# EAGLE schematic LaserCutter (EAGLE 6.2)
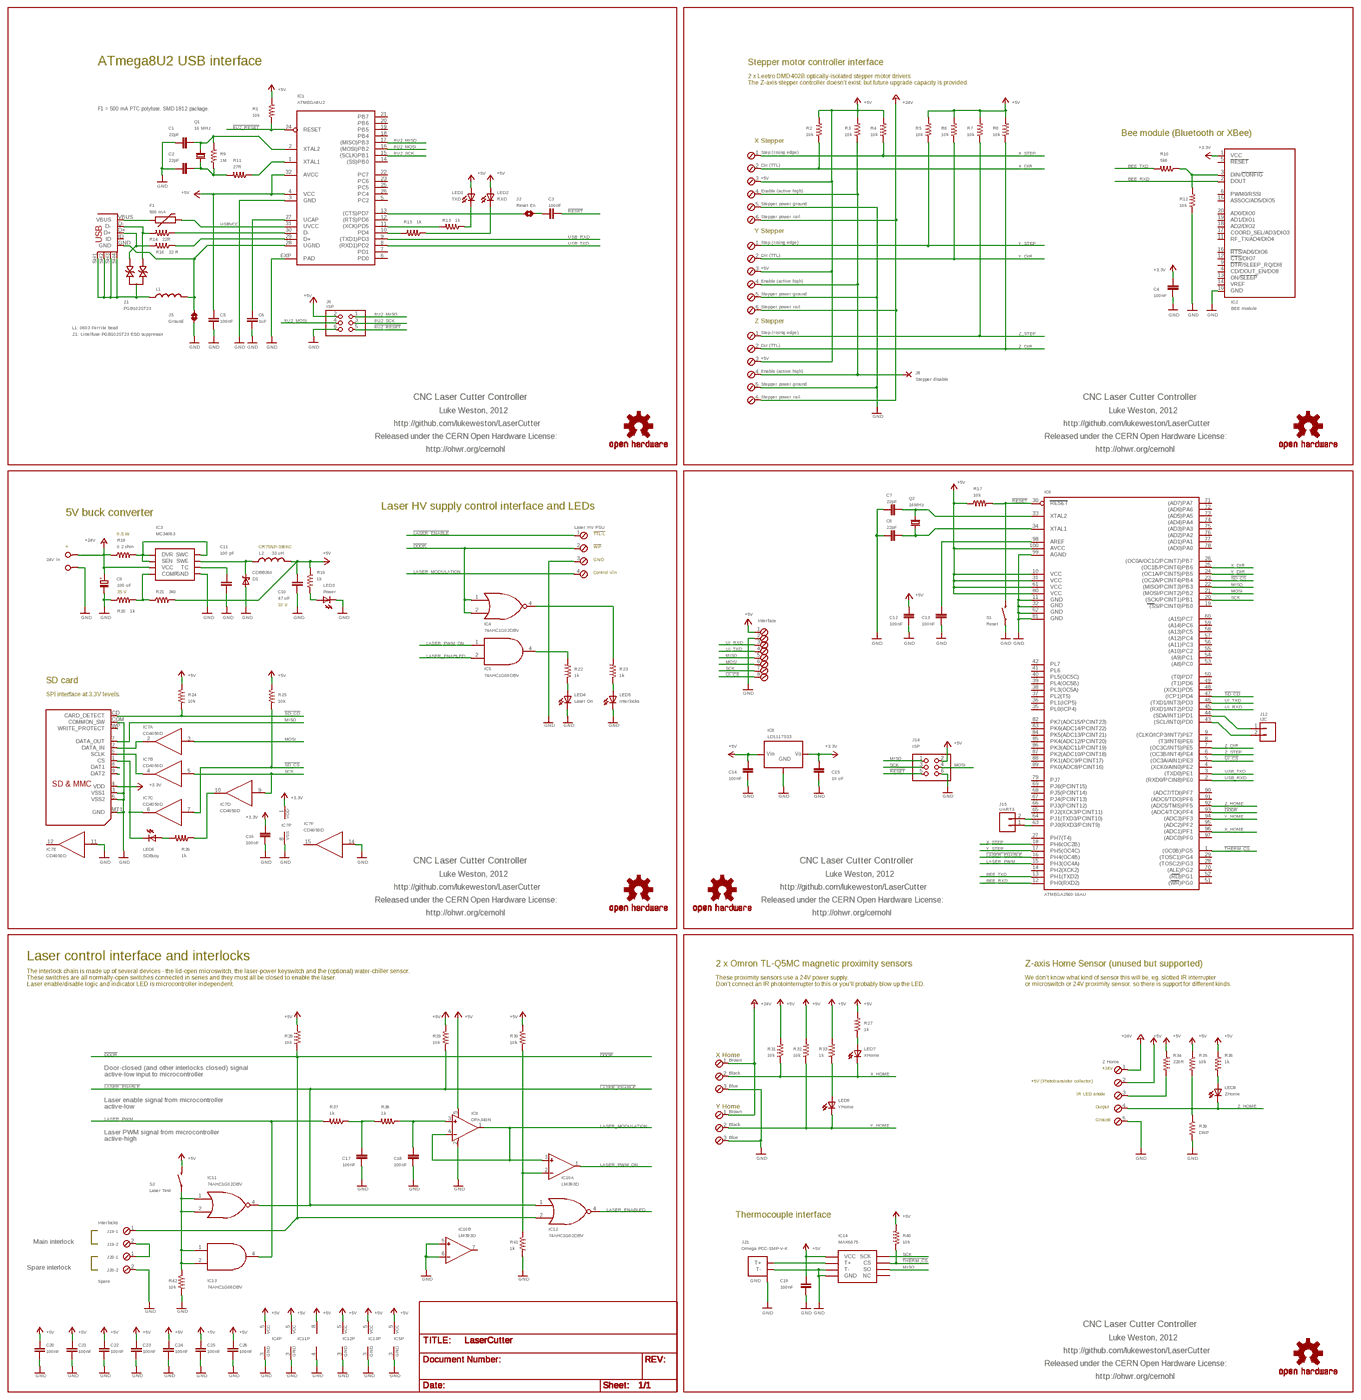
[diagram p0: schematic, sheet 1, overview]
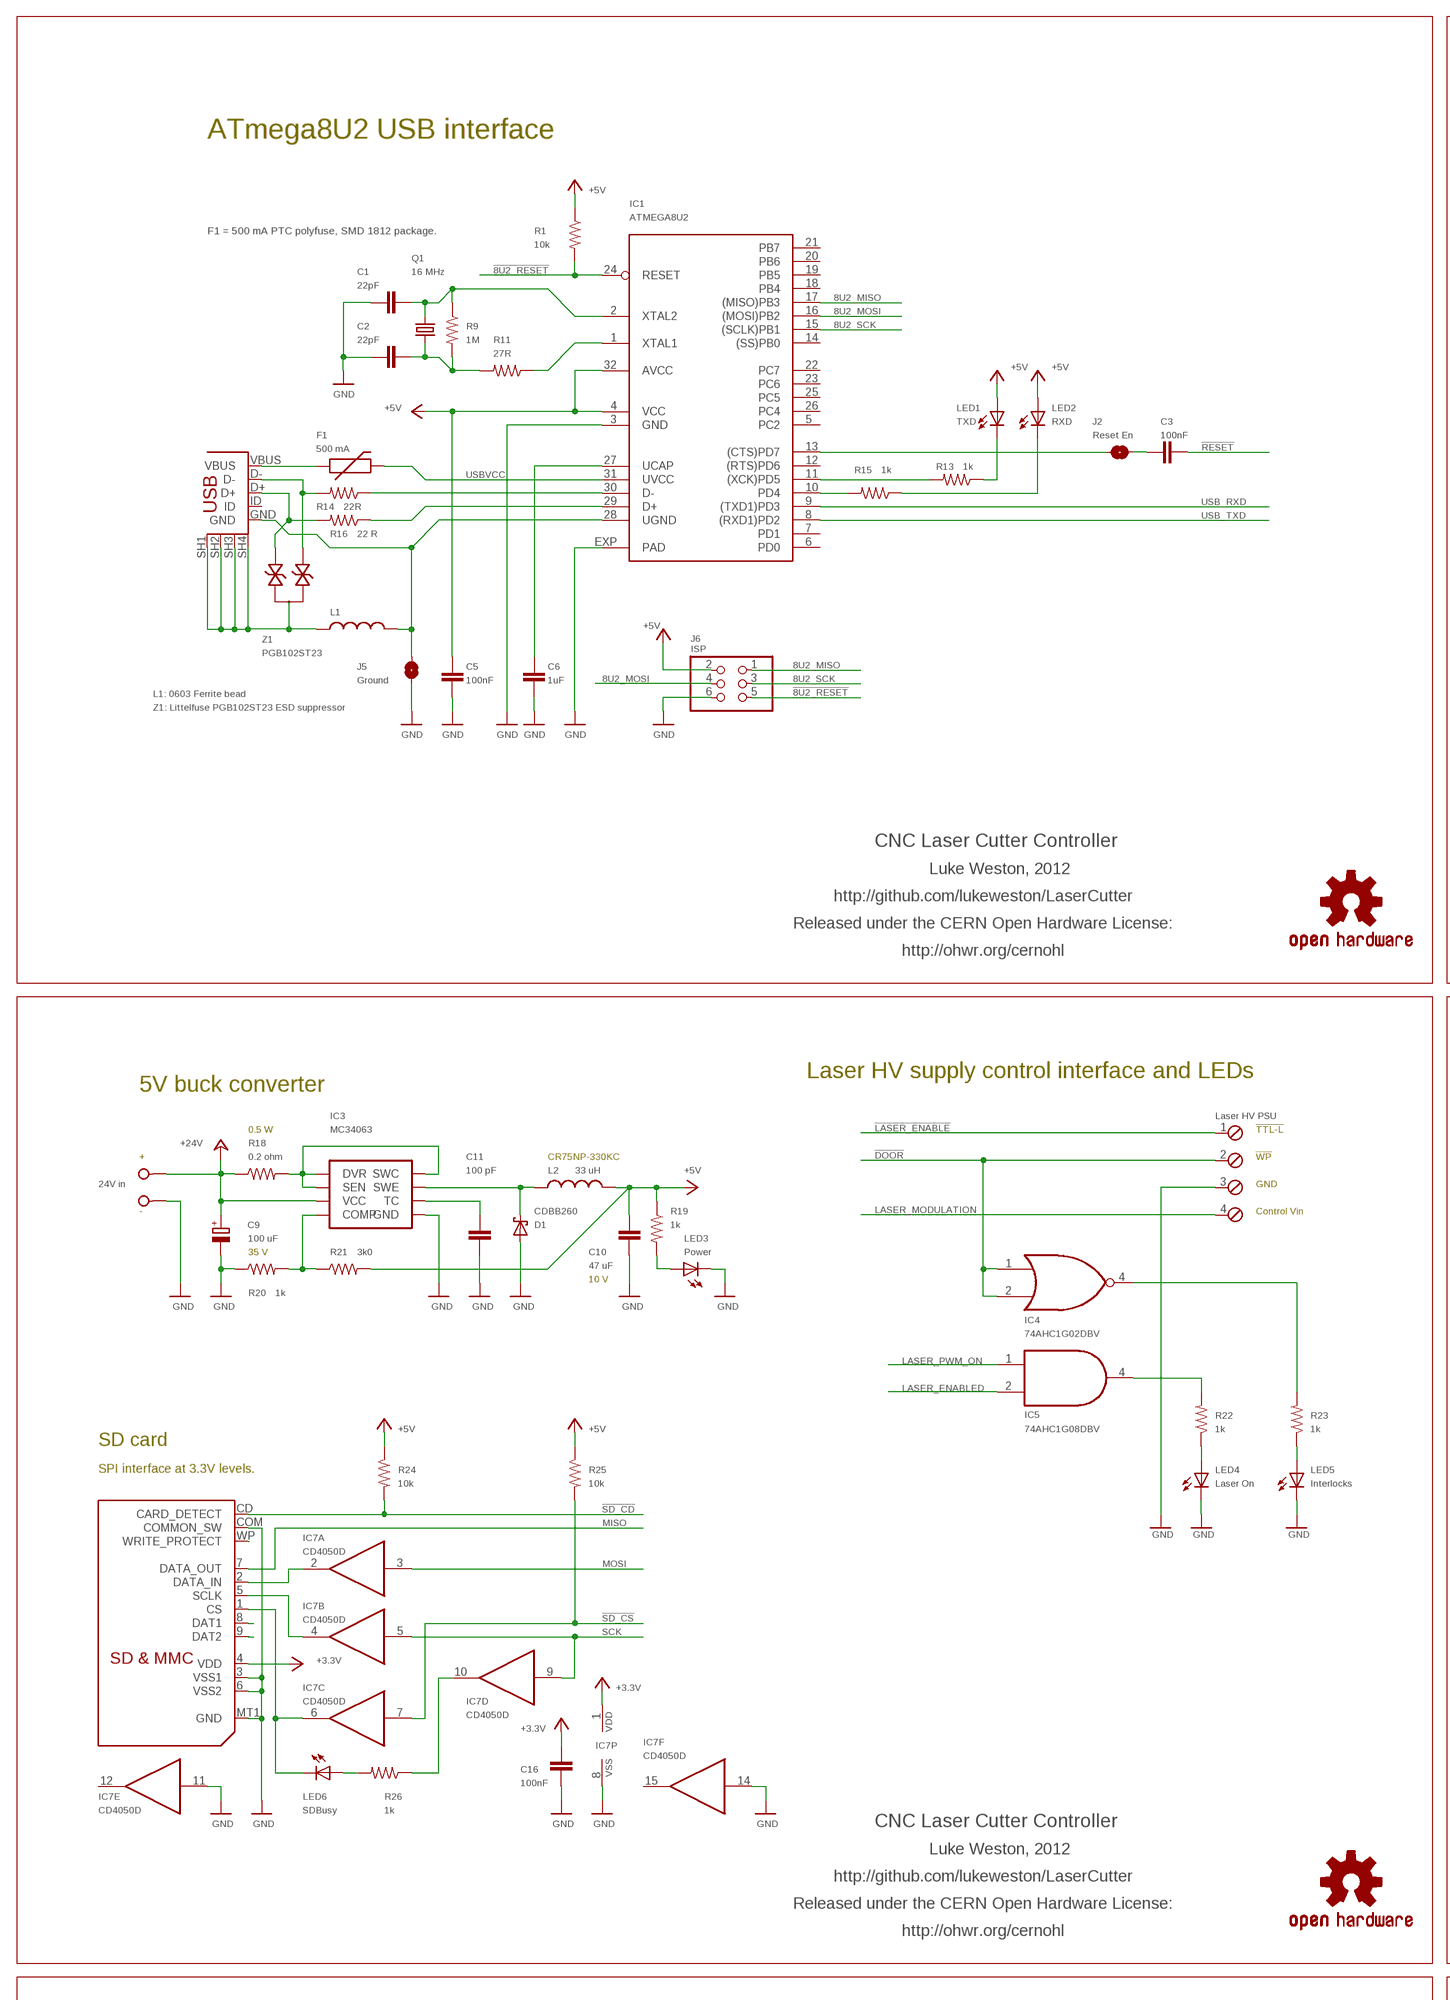
[diagram p1: schematic, sheet 1, part 1 of 4]
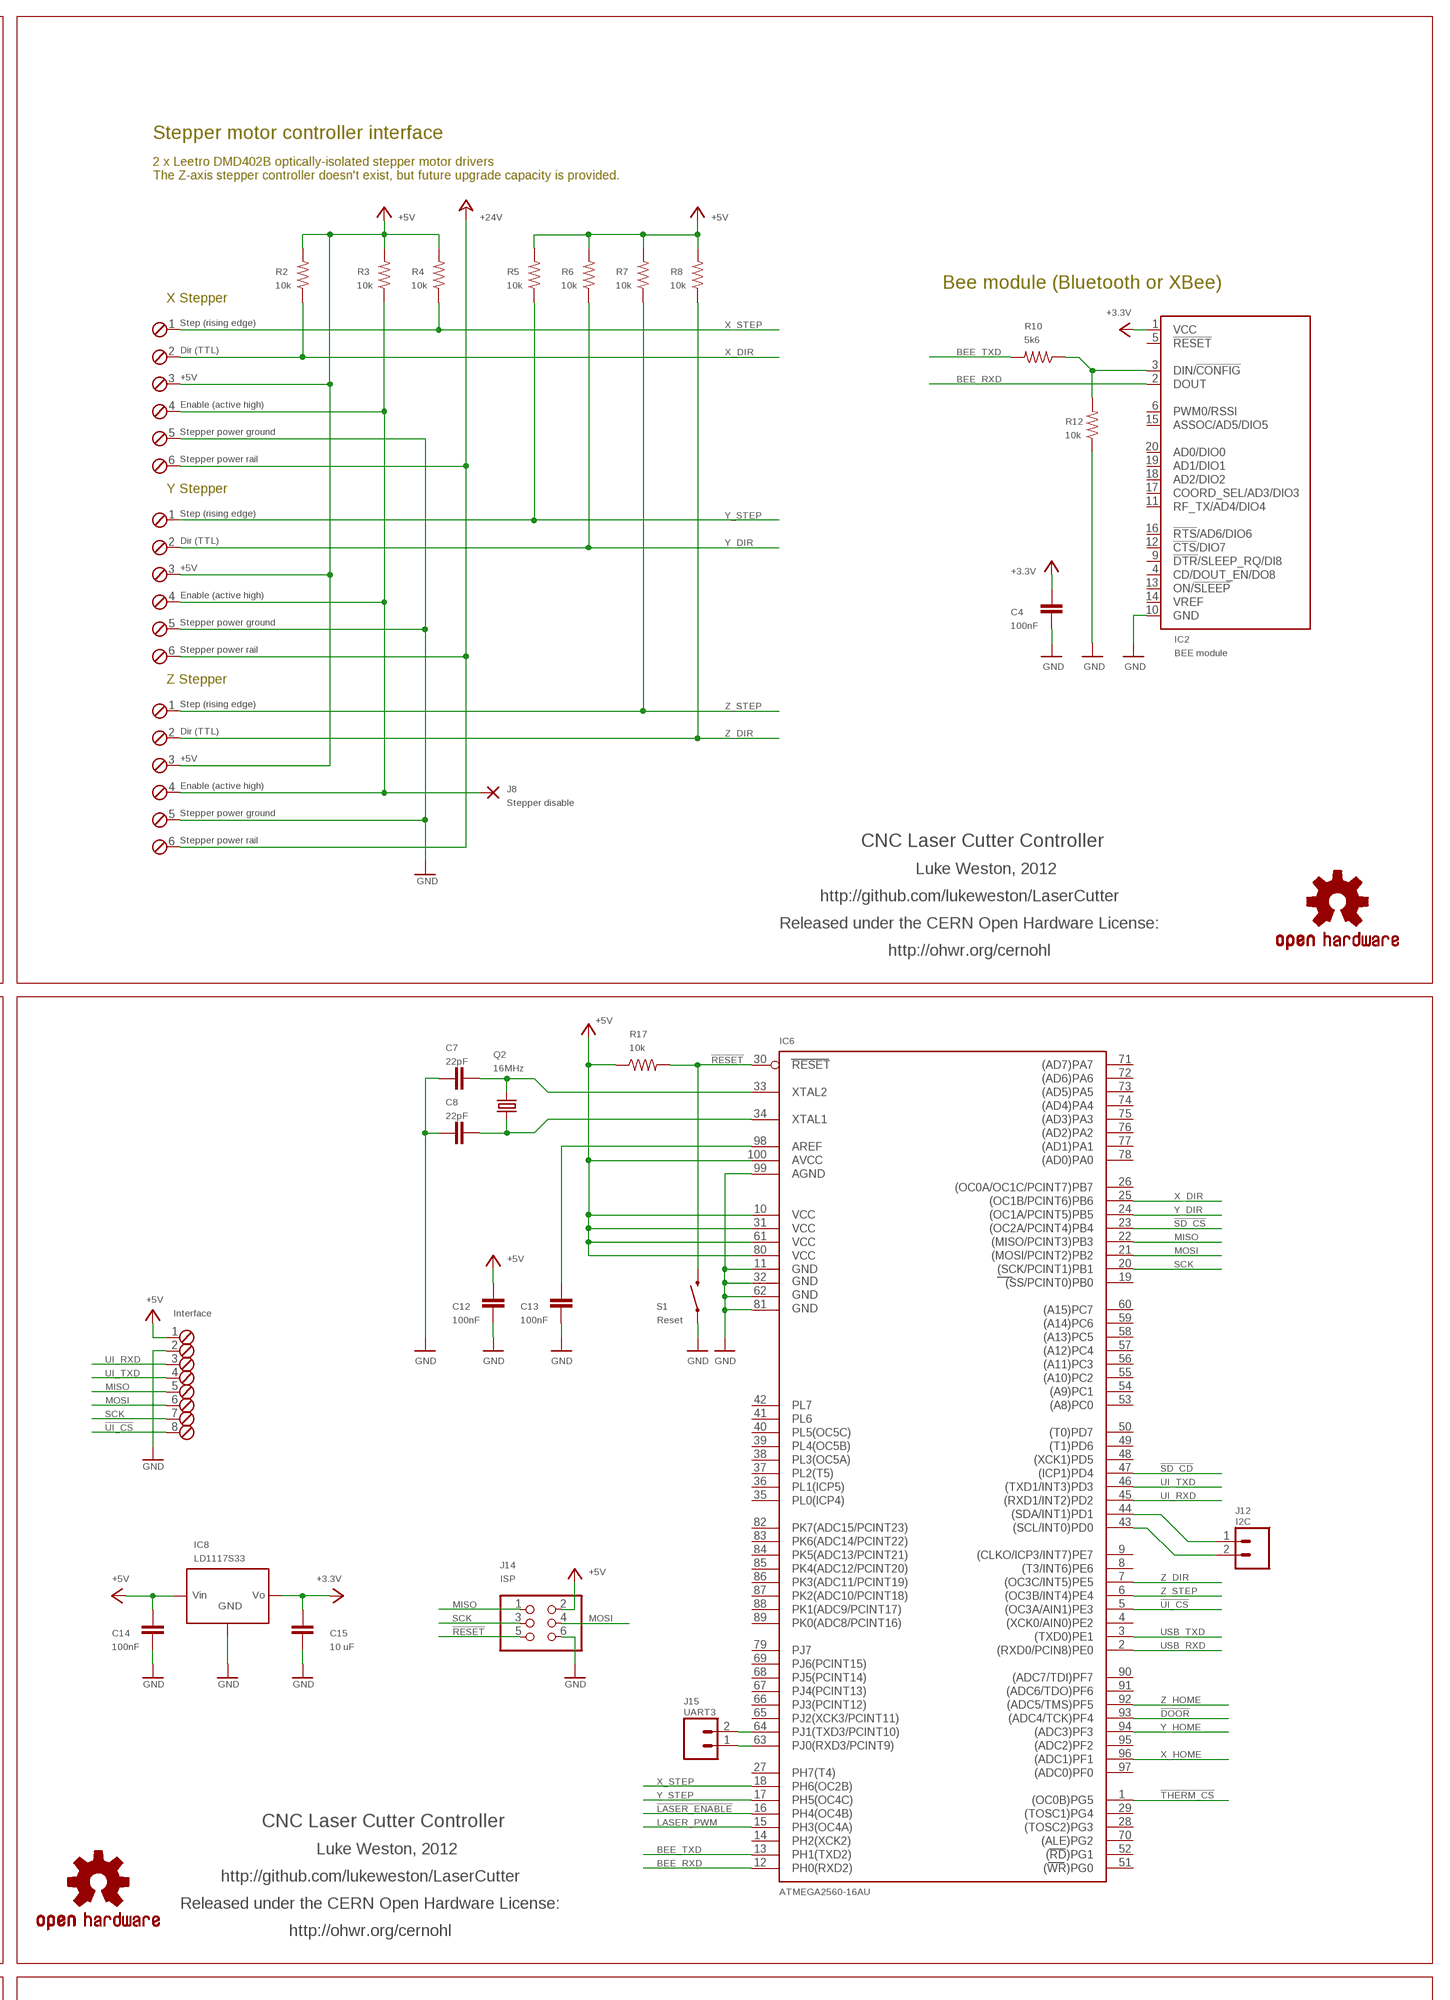
[diagram p2: schematic, sheet 1, part 2 of 4]
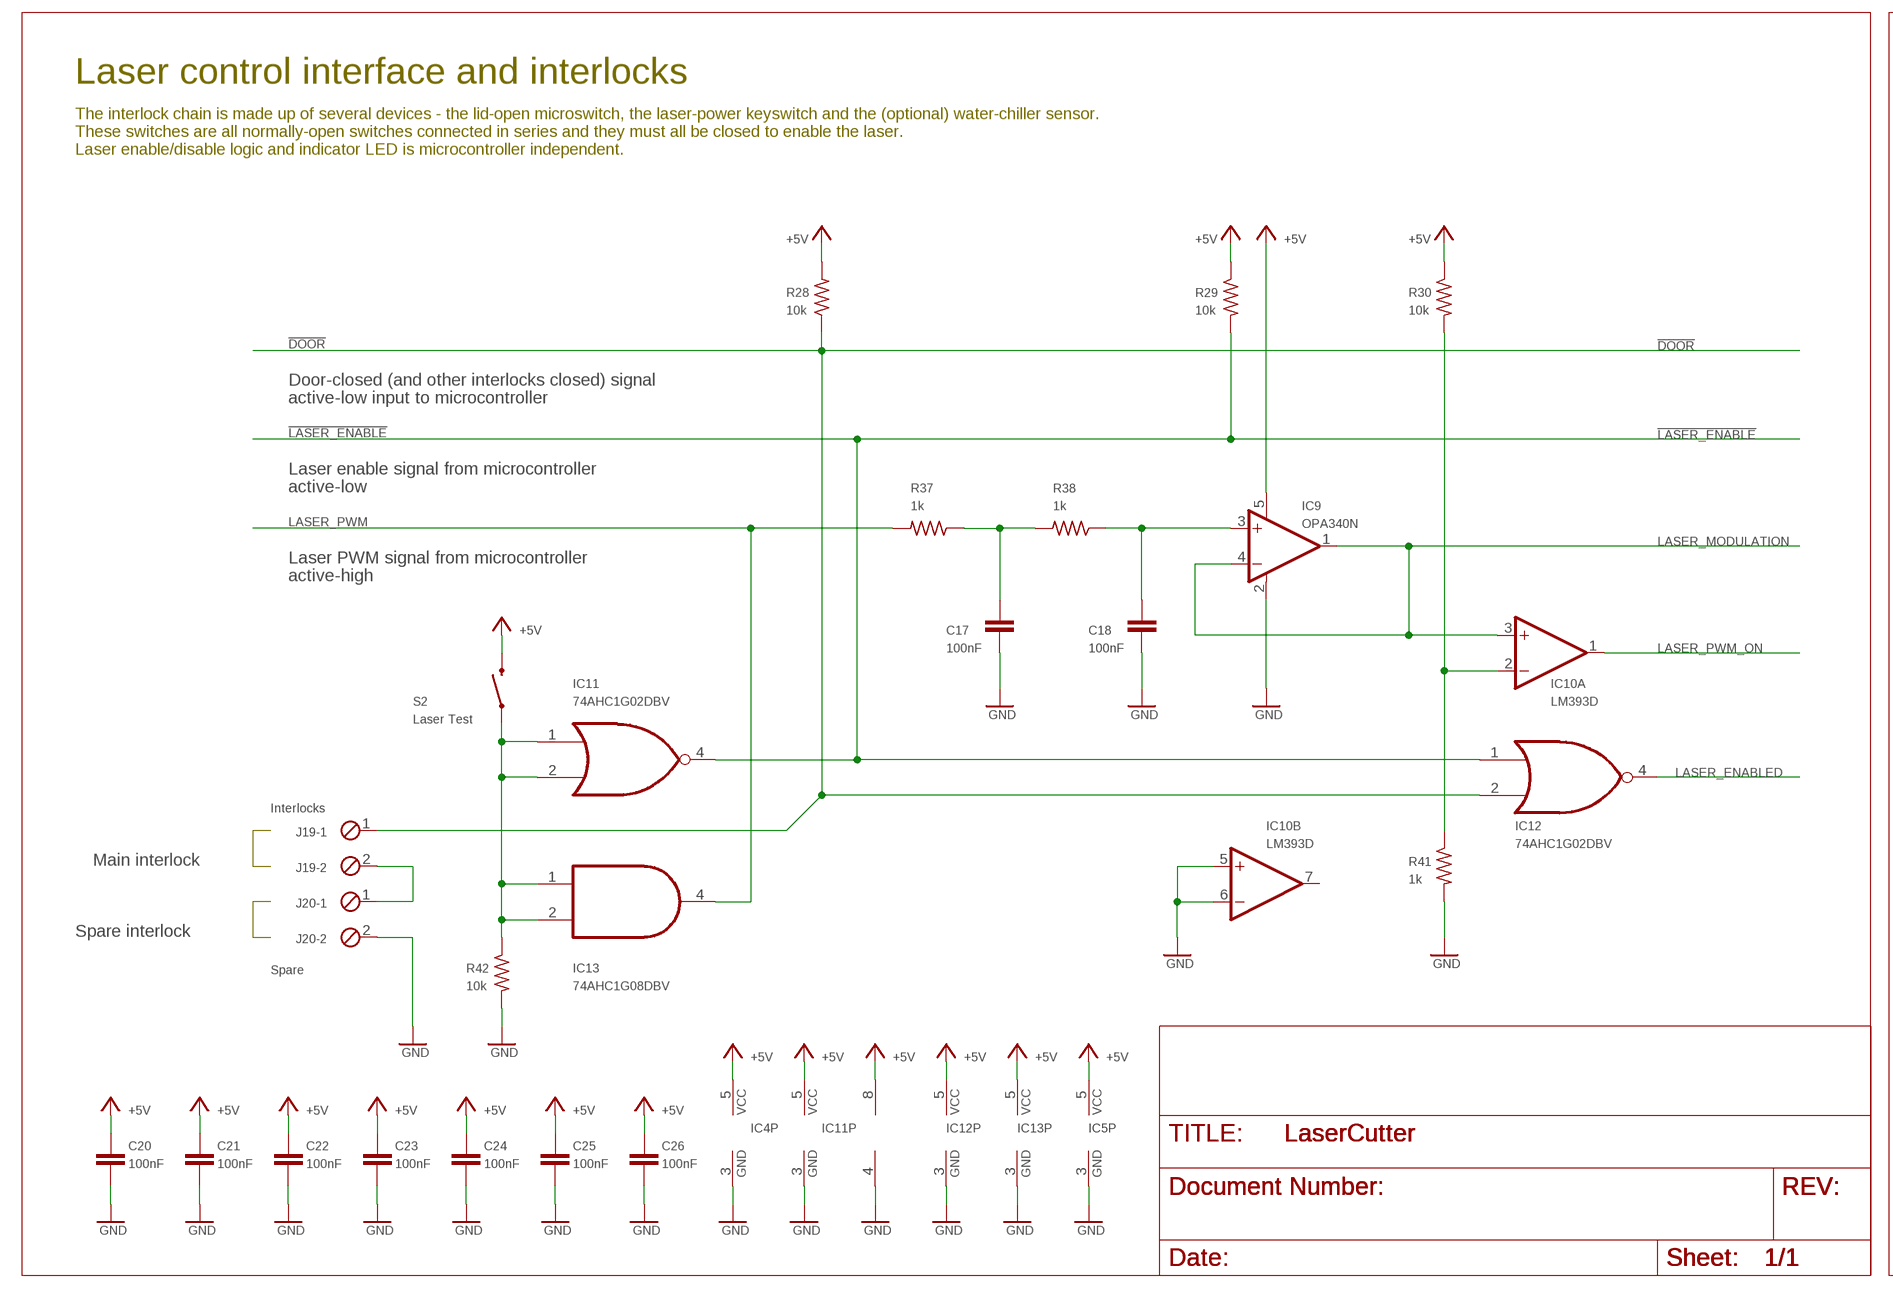
[diagram p3: schematic, sheet 1, part 3 of 4]
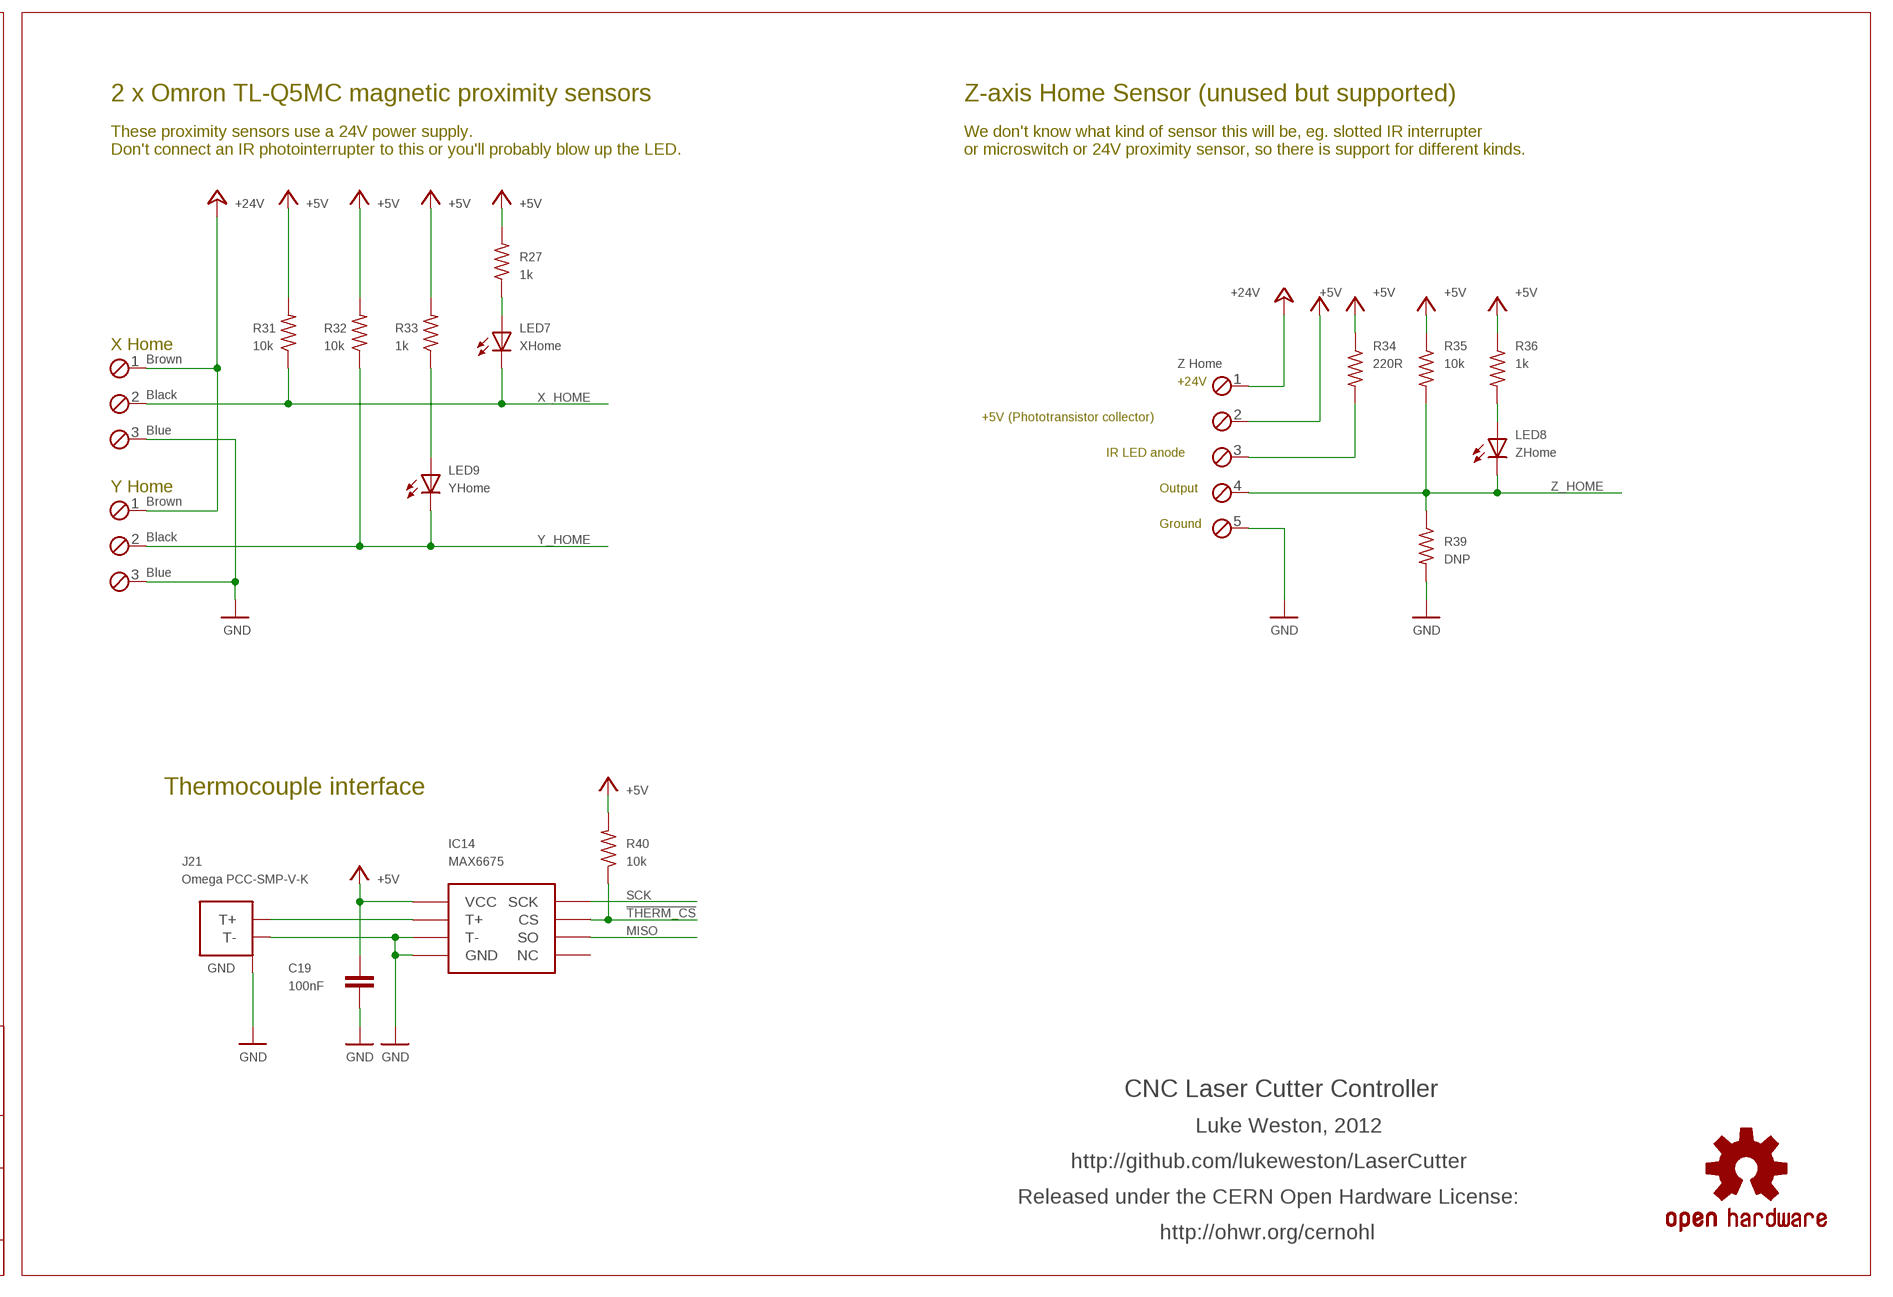
[diagram p4: schematic, sheet 1, part 4 of 4]

## Parts
$1  OSHW-LOGOS  [OSHW-LOGO-S]
C1  22pF  CAP0805-LARGE  [0805-LARGE]
C2  22pF  CAP0805-LARGE  [0805-LARGE]
C3  100nF  CAP0805-LARGE  [0805-LARGE]
C4  100nF  C-EUC0805K  [C0805K]
C5  100nF  CAP0805-LARGE  [0805-LARGE]
C6  1uF  CAP0805-LARGE  [0805-LARGE]
C7  22pF  C-EUC0805K  [C0805K]
C8  22pF  C-EUC0805K  [C0805K]
C9  100 uF  CPOL-EUE2.5-6  [E2,5-6]
C10  47 uF  C-EUC1210  [C1210]
C11  100 pF  CAP0805-LARGE  [0805-LARGE]
C12  100nF  C-EUC0805K  [C0805K]
C13  100nF  C-EUC0805K  [C0805K]
C14  100nF  C-EUC0805K  [C0805K]
C15  10 uF  C-EUC0805K  [C0805K]
C16  100nF  C-EUC0805K  [C0805K]
C17  100nF  C-EUC0805K  [C0805K]
C18  100nF  C-EUC0805K  [C0805K]
C19  100nF  C-EUC0805K  [C0805K]
C20  100nF  C-EUC0805K  [C0805K]
C21  100nF  C-EUC0805K  [C0805K]
C22  100nF  C-EUC0805K  [C0805K]
C23  100nF  C-EUC0805K  [C0805K]
C24  100nF  C-EUC0805K  [C0805K]
C25  100nF  C-EUC0805K  [C0805K]
C26  100nF  C-EUC0805K  [C0805K]
D1  CDBB260  MBRS130LT3  [SMB]
F1  500 mA  PTC1812  [1812]
IC1  ATMEGA8U2  ATMEL_ATMEGA8U2-MUQFN  [ATMEL_QFN32]
IC2  BEE module  XBEE  [XBEE-PRO]
IC3  MC34063  MC34063SMD  [SO08]
IC4  74AHC1G02DBV  [SOT23-5]
IC5  74AHC1G08DBV  [SOT23-5]
IC6  ATMEGA2560-16AU  ATMEGA1280-16AU  [TQFP100]
IC7  CD4050D  4050D  [SO16]
IC8  LD1117S33  REG1117  [SOT223]
IC9  OPA340N  [SOT23-5]
IC10  LM393D  [SO08]
IC11  74AHC1G02DBV  [SOT23-5]
IC12  74AHC1G02DBV  [SOT23-5]
IC13  74AHC1G08DBV  [SOT23-5]
IC14  MAX6675  [SOIC8-2]
J1  X Stepper  MPT6  [6POL254]
J2  Reset En  SJ  [SJ]
J3  USB  USB-FT  [USB-MINIB-FT]
J4  Y Stepper  MPT6  [6POL254]
J5  Ground  SJ  [SJ]
J6  ISP  PINHD-2X3  [2X03]
J7  Z Stepper  MPT6  [6POL254]
J8  Stepper disable  1,6/0,8  [1,6/0,8]
J9  Laser HV PSU  MPT4  [4POL254]
J10  24V in  W237-02P  [W237-132]
J11  Interface  MPT8  [8POL254]
J12  I2C  M02PTH  [1X02]
J13  SDMMC18650  [SDCARD]
J14  ISP  PINHD-2X3  [2X03]
J15  UART3  M02PTH  [1X02]
J16  X Home  MPT3  [3POL254]
J17  Z Home  MPT5  [5POL254]
J18  Y Home  MPT3  [3POL254]
J19  Interlocks  MPT2  [2POL254]
J20  Spare  MPT2  [2POL254]
J21  Omega PCC-SMP-V-K  PCC-SMP-V  [PCC-SMP-V]
L1  L1: 0603 Ferrite bead  INDUCTOR0603  [0603]
L2  33 uH  INDUCTORCR75  [CR75]
LED1  TXD  LED0805  [LED-0805]
LED2  RXD  LED0805  [LED-0805]
LED3  Power  LED0805-LARGE  [LED-0805-LARGE]
LED4  Laser On  LED0805-LARGE  [LED-0805-LARGE]
LED5  Interlocks  LED0805-LARGE  [LED-0805-LARGE]
LED6  SDBusy  LED0805-LARGE  [LED-0805-LARGE]
LED7  XHome  LED0805-LARGE  [LED-0805-LARGE]
LED8  ZHome  LED0805-LARGE  [LED-0805-LARGE]
LED9  YHome  LED0805-LARGE  [LED-0805-LARGE]
Q1  16 MHz  CRYSTAL5X3  [CRYSTAL-SMD-5X3]
Q2  16MHz  CRYSTAL5X3  [CRYSTAL-SMD-5X3]
R1  10k  R-US_R0805  [R0805]
R2  10k  R-US_M0805  [M0805]
R3  10k  R-US_M0805  [M0805]
R4  10k  R-US_M0805  [M0805]
R5  10k  R-US_M0805  [M0805]
R6  10k  R-US_M0805  [M0805]
R7  10k  R-US_M0805  [M0805]
R8  10k  R-US_M0805  [M0805]
R9  1M  R-US_R0805  [R0805]
R10  5k6  R-US_M0805  [M0805]
R11  27R  R-US_R0805  [R0805]
R12  10k  R-US_M0805  [M0805]
R13  1k  R-US_R0805  [R0805]
R14  22R  R-US_R0805  [R0805]
R15  1k  R-US_R0805  [R0805]
R16  22 R  R-US_R0805  [R0805]
R17  10k  R-US_R0805  [R0805]
R18  0.2 ohm  R-US_R1210  [R1210]
R19  1k  R-US_R0805  [R0805]
R20  1k  R-US_R0805  [R0805]
R21  3k0  R-US_R0805  [R0805]
R22  1k  R-US_M0805  [M0805]
R23  1k  R-US_M0805  [M0805]
R24  10k  R-US_M0805  [M0805]
R25  10k  R-US_M0805  [M0805]
R26  1k  R-US_R0805  [R0805]
R27  1k  R-US_M0805  [M0805]
R28  10k  R-US_R0805  [R0805]
R29  10k  R-US_M0805  [M0805]
R30  10k  R-US_M0805  [M0805]
R31  10k  R-US_M0805  [M0805]
R32  10k  R-US_M0805  [M0805]
R33  1k  R-US_M0805  [M0805]
R34  220R  R-US_M0805  [M0805]
R35  10k  R-US_M0805  [M0805]
R36  1k  R-US_M0805  [M0805]
R37  1k  R-US_M0805  [M0805]
R38  1k  R-US_M0805  [M0805]
R39  DNP  R-US_M0805  [M0805]
R40  10k  R-US_M0805  [M0805]
R41  1k  R-US_M0805  [M0805]
R42  10k  R-US_M0805  [M0805]
S1  Reset  SWITCH-MOMENTARY-2SMD  [TACTILE_SWITCH_SMD]
S2  Laser Test  SWITCH-MOMENTARY-2SMD  [TACTILE_SWITCH_SMD]
U$  OSHW-LOGOS  [OSHW-LOGO-S]
U$1  OSHW-LOGOS  [OSHW-LOGO-S]
U$2  OSHW-LOGOS  [OSHW-LOGO-S]
U$3  OSHW-LOGOS  [OSHW-LOGO-S]
Z1  PGB102ST23  [SOT23-3]

## Nets
8U2_MISO: IC1.17((MISO)PB3) J6.1
8U2_MOSI: IC1.16((MOSI)PB2) J6.4
8U2_SCK: IC1.15((SCLK)PB1) J6.3
!8U2_RESET: IC1.24(RESET) J6.5 R1.2
!DOOR: IC4.1(I0) IC4.2(I1) IC6.93((ADC4/TCK)PF4) IC12.2(I1) J9.2 J19.1 R28.1
!LASER_ENABLE: IC6.16(PH4(OC4B)) IC11.4(O) IC12.1(I0) J9.1 R29.2
!RESET: C3.2 IC6.30(RESET) J14.5 R17.2 S1.3
!SD_CD: IC6.47((ICP1)PD4) J13.CD(CARD_DETECT) R24.2
!SD_CS: IC6.23((OC2A/PCINT4)PB4) IC7.7(C:I) R25.2
!THERM_CS: IC6.1((OC0B)PG5) IC14.6(CS) R40.1
!UI_CS: IC6.5((OC3A/AIN1)PE3) J11.8
+3V3: C4.1 C15.1 C16.1 IC2.1(VCC) IC7.1(P:VDD) IC8.2(VOUT) J13.4(VDD) ; supply symbol labelled +3.3V
+5V: C5.1 C10.1 C12.2 C14.1 C19.1 C20.1 C21.1 C22.1 C23.1 C24.1 C25.1 C26.1 IC1.4(VCC) IC1.32(AVCC) IC4.5(VCC) IC5.5(VCC) IC6.10(VCC) IC6.31(VCC1) IC6.61(VCC2) IC6.80(VCC3) IC6.100(AVCC) IC8.3(VIN) IC9.5(V+) IC10.8(P:V+) IC11.5(VCC) IC12.5(VCC) IC13.5(VCC) IC14.4(VCC) J1.3 J4.3 J6.2 J7.3 J11.1 J14.2 J17.2 L2.P$2 LED1.A LED2.A R1.1 R2.2 R3.2 R4.2 R5.2 R6.2 R7.2 R8.2 R17.1 R19.1 R21.2 R24.1 R25.1 R27.2 R28.2 R29.1 R30.1 R31.2 R32.2 R33.2 R34.1 R35.1 R36.1 R40.2 S2.3
+24V: C9.+ IC3.6(VCC) J1.6 J4.6 J7.6 J10.1 J16.1 J17.1 J18.1 R18.1
BEE_RXD: IC2.2(DOUT) IC6.12(PH0(RXD2))
BEE_TXD: IC6.13(PH1(TXD2)) R10.2
DAT1: J13.8(DAT1)
DAT2: J13.9(DAT2)
GND: C1.1 C2.1 C4.2 C5.2 C6.2 C7.1 C8.1 C9.- C10.2 C11.2 C12.1 C13.1 C14.2 C15.2 C16.2 C17.2 C18.2 C19.2 C20.2 C21.2 C22.2 C23.2 C24.2 C25.2 C26.2 D1.A IC1.3(GND) IC1.EXP(PAD) IC2.10(GND) IC3.4(GND) IC4.3(GND) IC5.3(GND) IC6.11(GND) IC6.32(GND1) IC6.62(GND2) IC6.81(GND3) IC6.99(AGND) IC7.8(P:VSS) IC7.11(E:I) IC7.14(F:I) IC8.1(GND) IC9.2(V-) IC10.4(P:V-) IC10.5(B:+IN) IC10.6(B:-IN) IC11.3(GND) IC12.3(GND) IC13.3(GND) IC14.1(GND) IC14.2(T-) J1.5 J4.5 J5.2 J6.6 J7.5 J9.3 J10.2 J11.2 J13.3(VSS1) J13.6(VSS2) J13.COM(COMMON_SW) J13.MT1(GND) J14.6 J16.3 J17.5 J18.3 J20.2 J21.P$1(GND) J21.P$2(GND) J21.T- LED3.C LED4.C LED5.C R12.1 R20.1 R39.2 R41.2 R42.2 S1.1
J81: J1.4 J4.4 J7.4 J8.1(P) R3.1
LASER_ENABLED: IC5.2(I1) IC12.4(O)
LASER_MODULATION: IC9.1(OUT) IC9.4(-IN) IC10.3(A:+IN) J9.4
LASER_PWM: IC6.15(PH3(OC4A)) IC13.4(O) R37.2
LASER_PWM_ON: IC5.1(I0) IC10.1(A:OUT)
MISO: IC6.22((MISO/PCINT3)PB3) IC14.7(SO) J11.5 J13.7(DATA_OUT) J14.1
MOSI: IC6.21((MOSI/PCINT2)PB2) IC7.3(A:I) J11.6 J14.4
N$1: IC7.2(A:O) J13.2(DATA_IN)
N$2: LED3.A R19.2
N$4: C7.2 IC6.33(XTAL2) Q2.3
N$5: IC2.3(DIN/!CONFIG) R10.1 R12.2
N$6: IC1.28(UGND) J3.GND J5.1 L1.2
N$7: IC11.1(I0) IC11.2(I1) IC13.1(I0) IC13.2(I1) R42.1 S2.1
N$8: IC3.1(SWC) IC3.7(SEN) IC3.8(DVR) R18.2
N$9: IC7.4(B:O) J13.5(SCLK)
N$10: LED6.A R26.2
N$11: C11.1 IC3.3(TC)
N$12: J19.2 J20.1
N$13: IC3.5(COMP) R20.2 R21.1
N$16: LED8.A R36.2
N$17: IC10.2(A:-IN) R30.2 R41.1
N$18: IC7.10(D:O) R26.1
N$19: IC7.6(C:O) J13.1(CS) LED6.C
N$21: D1.C IC3.2(SWE) L2.P$1
N$22: IC5.4(O) R22.2
N$23: LED4.A R22.1
N$24: C18.1 IC9.3(+IN) R38.1
N$25: IC14.3(T+) J21.T+
N$26: C17.1 R37.1 R38.2
N$28: IC4.4(O) R23.2
N$29: LED9.A R33.1
N$30: LED5.A R23.1
N$33: LED7.A R27.1
N$35: J17.3 R34.2
N$36: C8.2 IC6.34(XTAL1) Q2.1
N$38: C13.2 IC6.98(AREF)
N$94: C1.2 IC1.2(XTAL2) Q1.3 R9.1
N$95: IC1.1(XTAL1) R11.1
N$96: C2.2 Q1.1 R9.2 R11.2
N$97: F1.1 J3.VBUS
N$98: J3.D+ R16.2 Z1.2
N$100: C6.1 IC1.27(UCAP)
N$101: J3.D- R14.2 Z1.1
N$103: IC1.30(D-) R14.1
N$104: IC1.29(D+) R16.1
N$105: LED2.C R15.1
N$107: C3.1 J2.2
N$109: IC1.13((CTS)PD7) J2.1
N$110: IC1.11((XCK)PD5) R13.2
N$111: IC1.10(PD4) R15.2
N$116: LED1.C R13.1
N$120: J3.SH1(SH$1) J3.SH2(SH$2) J3.SH3(SH$3) J3.SH4(SH$4) L1.1 Z1.3
RXD3: IC6.63(PJ0(RXD3/PCINT9)) J15.1
SCK: IC6.20((SCK/PCINT1)PB1) IC7.5(B:I) IC7.9(D:I) IC14.5(SCK) J11.7 J14.3
SCL: IC6.43((SCL/INT0)PD0) J12.2
SDA: IC6.44((SDA/INT1)PD1) J12.1
TXD3: IC6.64(PJ1(TXD3/PCINT10)) J15.2
UI_RXD: IC6.45((RXD1/INT2)PD2) J11.3
UI_TXD: IC6.46((TXD1/INT3)PD3) J11.4
USB_RXD: IC1.9((TXD1)PD3) IC6.2((RXD0/PCIN8)PE0)
USB_TXD: IC1.8((RXD1)PD2) IC6.3((TXD0)PE1)
USBVCC: F1.2 IC1.31(UVCC)
WP: J13.WP(WRITE_PROTECT)
X_DIR: IC6.25((OC1B/PCINT6)PB6) J1.2 R2.1
X_HOME: IC6.96((ADC1)PF1) J16.2 LED7.C R31.1
X_STEP: IC6.18(PH6(OC2B)) J1.1 R4.1
Y_DIR: IC6.24((OC1A/PCINT5)PB5) J4.2 R6.1
Y_HOME: IC6.94((ADC3)PF3) J18.2 LED9.C R32.1
Y_STEP: IC6.17(PH5(OC4C)) J4.1 R5.1
Z_DIR: IC6.7((OC3C/INT5)PE5) J7.2 R8.1
Z_HOME: IC6.92((ADC5/TMS)PF5) J17.4 LED8.C R35.2 R39.1
Z_STEP: IC6.6((OC3B/INT4)PE4) J7.1 R7.1
Unconnected: IC1.5(PC2) IC1.6(PD0) IC1.7(PD1) IC1.12((RTS)PD6) IC1.14((SS)PB0) IC1.18(PB4) IC1.19(PB5) IC1.20(PB6) IC1.21(PB7) IC1.22(PC7) IC1.23(PC6) IC1.25(PC5) IC1.26(PC4) IC2.4(CD/DOUT_EN/DO8) IC2.5(!RESET) IC2.6(PWM0/RSSI) IC2.9(!DTR!/SLEEP_RQ/DI8) IC2.11(RF_TX/AD4/DIO4) IC2.12(!CTS!/DIO7) IC2.13(ON/!SLEEP) IC2.14(VREF) IC2.15(ASSOC/AD5/DIO5) IC2.16(!RTS!/AD6/DIO6) IC2.17(COORD_SEL/AD3/DIO3) IC2.18(AD2/DIO2) IC2.19(AD1/DIO1) IC2.20(AD0/DIO0) IC6.4((XCK0/AIN0)PE2) IC6.8((T3/INT6)PE6) IC6.9((CLKO/ICP3/INT7)PE7) IC6.14(PH2(XCK2)) IC6.19((SS/PCINT0)PB0) IC6.26((OC0A/OC1C/PCINT7)PB7) IC6.27(PH7(T4)) IC6.28((TOSC2)PG3) IC6.29((TOSC1)PG4) IC6.35(PL0(ICP4)) IC6.36(PL1(ICP5)) IC6.37(PL2(T5)) IC6.38(PL3(OC5A)) IC6.39(PL4(OC5B)) IC6.40(PL5(OC5C)) IC6.41(PL6) IC6.42(PL7) IC6.48((XCK1)PD5) IC6.49((T1)PD6) IC6.50((T0)PD7) IC6.51((WR)PG0) IC6.52((RD)PG1) IC6.53((A8)PC0) IC6.54((A9)PC1) IC6.55((A10)PC2) IC6.56((A11)PC3) IC6.57((A12)PC4) IC6.58((A13)PC5) IC6.59((A14)PC6) IC6.60((A15)PC7) IC6.65(PJ2(XCK3/PCINT11)) IC6.66(PJ3(PCINT12)) IC6.67(PJ4(PCINT13)) IC6.68(PJ5(PCINT14)) IC6.69(PJ6(PCINT15)) IC6.70((ALE)PG2) IC6.71((AD7)PA7) IC6.72((AD6)PA6) IC6.73((AD5)PA5) IC6.74((AD4)PA4) IC6.75((AD3)PA3) IC6.76((AD2)PA2) IC6.77((AD1)PA1) IC6.78((AD0)PA0) IC6.79(PJ7) IC6.82(PK7(ADC15/PCINT23)) IC6.83(PK6(ADC14/PCINT22)) IC6.84(PK5(ADC13/PCINT21)) IC6.85(PK4(ADC12/PCINT20)) IC6.86(PK3(ADC11/PCINT19)) IC6.87(PK2(ADC10/PCINT18)) IC6.88(PK1(ADC9/PCINT17)) IC6.89(PK0(ADC8/PCINT16)) IC6.90((ADC7/TDI)PF7) IC6.91((ADC6/TDO)PF6) IC6.95((ADC2)PF2) IC6.97((ADC0)PF0) IC7.12(E:O) IC7.15(F:O) IC10.7(B:OUT) IC14.8(NC) J3.ID

## Notes on the sheet
- ATmega8U2 USB interface | Stepper motor controller interface
- 2 x Leetro DMD402B optically-isolated stepper motor drivers
- The Z-axis stepper controller doesn't exist, but future upgrade capacity is provided.
- F1 = 500 mA PTC polyfuse, SMD 1812 package.
- Bee module (Bluetooth or XBee)
- Step (rising edge)
- Dir (TTL)
- +5V
- Enable (active high)
- Stepper power ground
- Stepper power rail
- Step (rising edge)
- Dir (TTL)
- +5V
- Enable (active high)
- Stepper power ground
- Stepper power rail
- Step (rising edge)
- Z1: Littelfuse PGB102ST23 ESD suppressor
- Dir (TTL)
- +5V
- Enable (active high)
- Stepper power ground
- Stepper power rail
- CNC Laser Cutter Controller | CNC Laser Cutter Controller
- Luke Weston, 2012 | Luke Weston, 2012
- http://github.com/lukeweston/LaserCutter | http://github.com/lukeweston/LaserCutter
- Released under the CERN Open Hardware License: | Released under the CERN Open Hardware License:
- http://ohwr.org/cernohl | http://ohwr.org/cernohl
- Laser HV supply control interface and LEDs
- 5V buck converter
- 0.5 W | !TTL-L
- + | CR75NP-330KC | !WP
- GND
- - | Control Vin
- 35 V
- 10 V
- SD card
- SPI interface at 3.3V levels.
- CNC Laser Cutter Controller | CNC Laser Cutter Controller
- Luke Weston, 2012 | Luke Weston, 2012
- http://github.com/lukeweston/LaserCutter | http://github.com/lukeweston/LaserCutter
- Released under the CERN Open Hardware License: | Released under the CERN Open Hardware License:
- http://ohwr.org/cernohl | http://ohwr.org/cernohl
- Laser control interface and interlocks
- 2 x Omron TL-Q5MC magnetic proximity sensors | Z-axis Home Sensor (unused but supported)
- The interlock chain is made up of several devices - the lid-open microswitch, the laser-power keyswitch and the (optional) water-chiller sensor.
- These switches are all normally-open switches connected in series and they must all be closed to enable the laser. | These proximity sensors use a 24V power supply. | We don't know what kind of sensor this will be, eg. slotted IR interrupter
- Laser enable/disable logic and indicator LED is microcontroller independent. | Don't connect an IR photointerrupter to this or you'll probably blow up the LED. | or microswitch or 24V proximity sensor, so there is support for different kinds.
- Brown
- Door-closed (and other interlocks closed) signal | +24V
- Black
- active-low input to microcontroller
- +5V (Phototransistor collector)
- Blue
- IR LED anode
- Laser enable signal from microcontroller
- active-low | Output
- Brown
- Ground
- Black
- Laser PWM signal from microcontroller
- Blue
- active-high
- Thermocouple interface
- Main interlock
- Spare interlock
- CNC Laser Cutter Controller
- Luke Weston, 2012
- http://github.com/lukeweston/LaserCutter
- Released under the CERN Open Hardware License:
- http://ohwr.org/cernohl

## Library data of the parts
$1 U$ U$1-U$3 = SparkFun:OSHW-LOGO: Open Source Hardware Logo This logo indicates the piece of hardware it is found on incorporates a OSHW license and/or adheres to the definition of open source hardware found here: http://freedomdefined.org/OSHW
C1-C3 C5 = freetronics-marc:CAP: Capacitor Standard 0603 ceramic capacitor, and 0.1" leaded capacitor.
C4 C7 C8 C10 C12-C26 = rcl:C-EU: CAPACITOR, European symbol
C6 C11 = freetronics-master-v1:CAP: Capacitor Standard 0603 ceramic capacitor, and 0.1" leaded capacitor.
C9 = rcl:CPOL-EU: POLARIZED CAPACITOR, European symbol
D1 = diode:MBRS130LT3: Schottky Power Rectifier Source: http://www.onsemi.com/pub/Collateral/MBRS130LT3-D.PDF
F1 = EtherMega2:PTC1812
IC1 = freetronics-jon:ATMEL_ATMEGA8U2-MU
IC2 = Luke:XBEE
IC3 = SparkFun:MC34063
IC4 IC11 IC12 = 74xx-little-us:74*1G02: 2-input NOR gate
IC5 IC13 = 74xx-little-us:74*1G08: 2-input AND gate
IC6 = atmel-2005:ATMEGA*: MICROCONTROLLER 64/128/256 Kbytes FLASH 4 Kbytes EEPROM 8 Kbytes SRAM 86 General Purpose I/O pins 12-channels16-bit PWM 4 x Serial USARTs 16-channels 10-bit A/D
IC7 = 40xx:4050: Hex non-inverting BUFFER
IC8 = burr-brown:REG1117: 800mA and 1A Low Dropout (LDO) Positive Regulator 1.8V, 2.5V, 2.85V, 3.3V, 5V, and Adj; MPN: REG1117; OC_FARNELL: 1097566; OC_NEWARK: 14P6981
IC9 = burr-brown:OPA340: Rail-to-Rail Operational Amplifiers Single-Supply, MicroAmplifier(TM) Series; MPN: OPA340NA/3KG4; OC_FARNELL: 1234805; OC_NEWARK: 13M5177
IC10 = linear:LM393: COMPARATOR
IC14 = Thermocouple:MAX6675: MAX6675 Thermocouple to Digital Converter
J1 J4 J7 = con-phoenix-254:MPT6: PHOENIX CONNECTOR; OC_FARNELL: unknown; OC_NEWARK: unknown
J2 J5 = jumper:SJ: SMD solder JUMPER
J3 = freetronics-master-v1:USB-FT
J6 J14 = freetronics-master-v1:PINHD-2X3: PIN HEADER
J8 = wirepad:1,6/0,8: THROUGH-HOLE PAD
J9 = con-phoenix-254:MPT4: PHOENIX CONNECTOR; OC_FARNELL: unknown; OC_NEWARK: unknown
J10 = con-wago-508:W237-02P: WAGO SREW CLAMP; OC_FARNELL: unknown; OC_NEWARK: unknown
J11 = con-phoenix-254:MPT8: PHOENIX CONNECTOR; OC_FARNELL: unknown; OC_NEWARK: unknown
J12 J15 = freetronics-master-v1:M02: Header 2 Standard 2-pin 0.1" header. Use with straight break away headers (SKU : PRT-00116), right angle break away headers (PRT-00553), swiss pins (PRT-00743), machine pins (PRT-00117), and female headers (PRT-00115). Molex polarized connector foot print use with SKU : PRT-08233 with associated crimp pins and housings.
J13 = adafruit:SDMMC: SD MMC Card holder 4UCON part #06132 - easy to solder
J16 J18 = con-phoenix-254:MPT3: PHOENIX CONNECTOR; OC_FARNELL: unknown; OC_NEWARK: unknown
J17 = con-phoenix-254:MPT5: PHOENIX CONNECTOR; OC_FARNELL: unknown; OC_NEWARK: unknown
J19 J20 = con-phoenix-254:MPT2: PHOENIX CONNECTOR; OC_FARNELL: unknown; OC_NEWARK: unknown
J21 = freetronics-luke:PCC-SMP-V: Omega PCC-SMP-V PCB-mount vertical minature thermocouple socket.
L1 = freetronics-master-v1:INDUCTOR: Inductors Basic Inductor/Choke - 0603 and 1206. Footprints are not proven and vary greatly between part numbers.
L2 = SparkFun:INDUCTOR: Inductors Basic Inductor/Choke - 0603 and 1206. Footprints are not proven and vary greatly between part numbers.
LED1-LED9 = freetronics:LED: LEDs Standard schematic elements and footprints for 5mm, 3mm, 1206, and 0603 sized LEDs. 5mm - Spark Fun Electronics SKU : COM-00529 (and others)
Q1 Q2 = SparkFun:CRYSTAL: Crystals Various standard crystals. Proven footprints. Spark Fun Electronics SKU : COM-00534
R1 R9 R11 R13-R21 R26 = rcl:R-US_: RESISTOR, American symbol
R2-R8 R10 R12 R22-R25 R27-R42 = resistor:R-US_: RESISTOR, American symbol
S1 S2 = SparkFun:SWITCH-MOMENTARY-2
Z1 = freetronics-luke:PGB102ST23: Littelfuse PGB1 ESD transient suppressor in dual SOT-23 package. http://www.littelfuse.com/data/en/Data_Sheets/Littelfuse_PulseGuard-ESD_PGB1.pdf